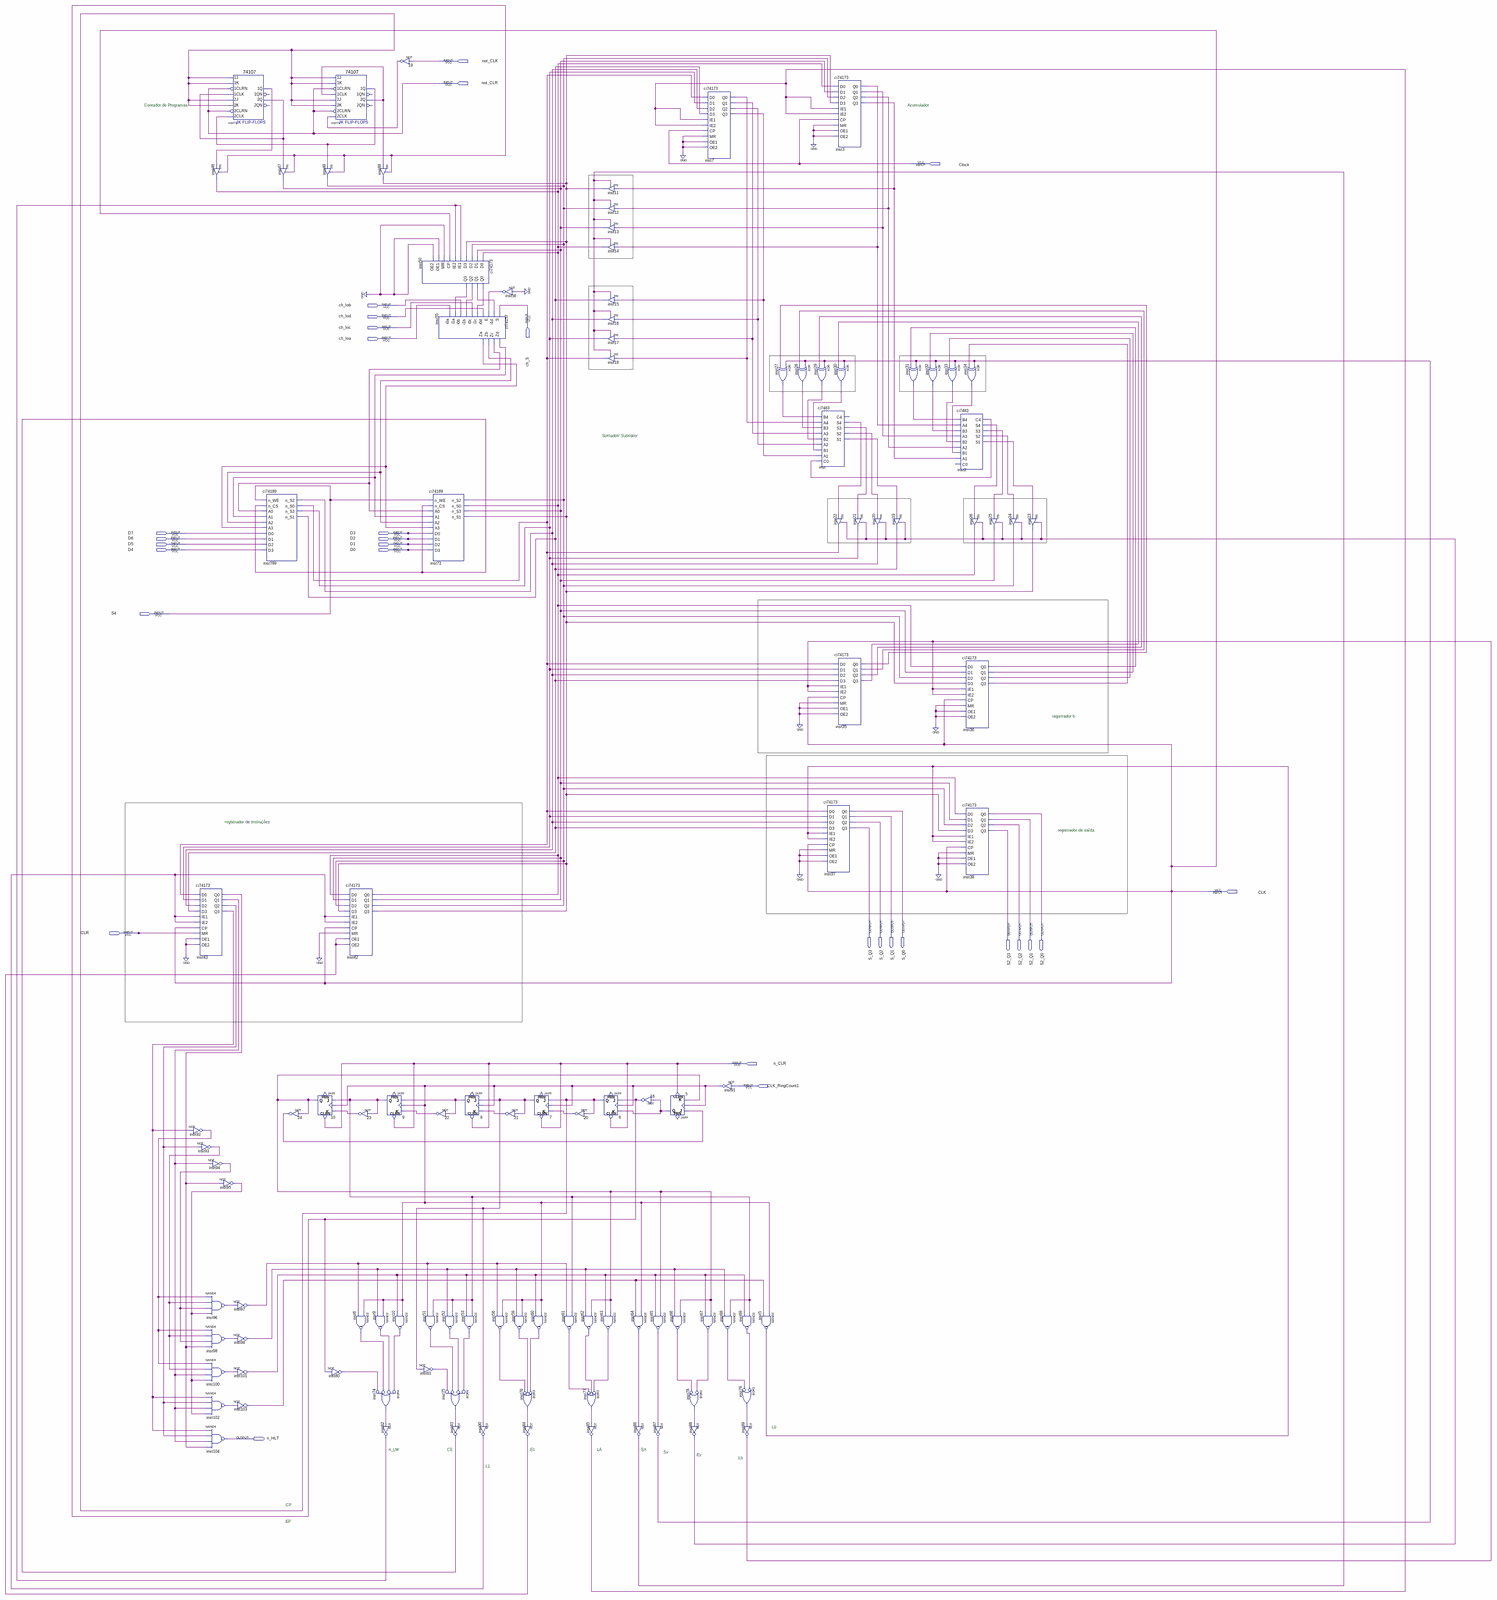
[diagram p0: schematic sheet, whole]
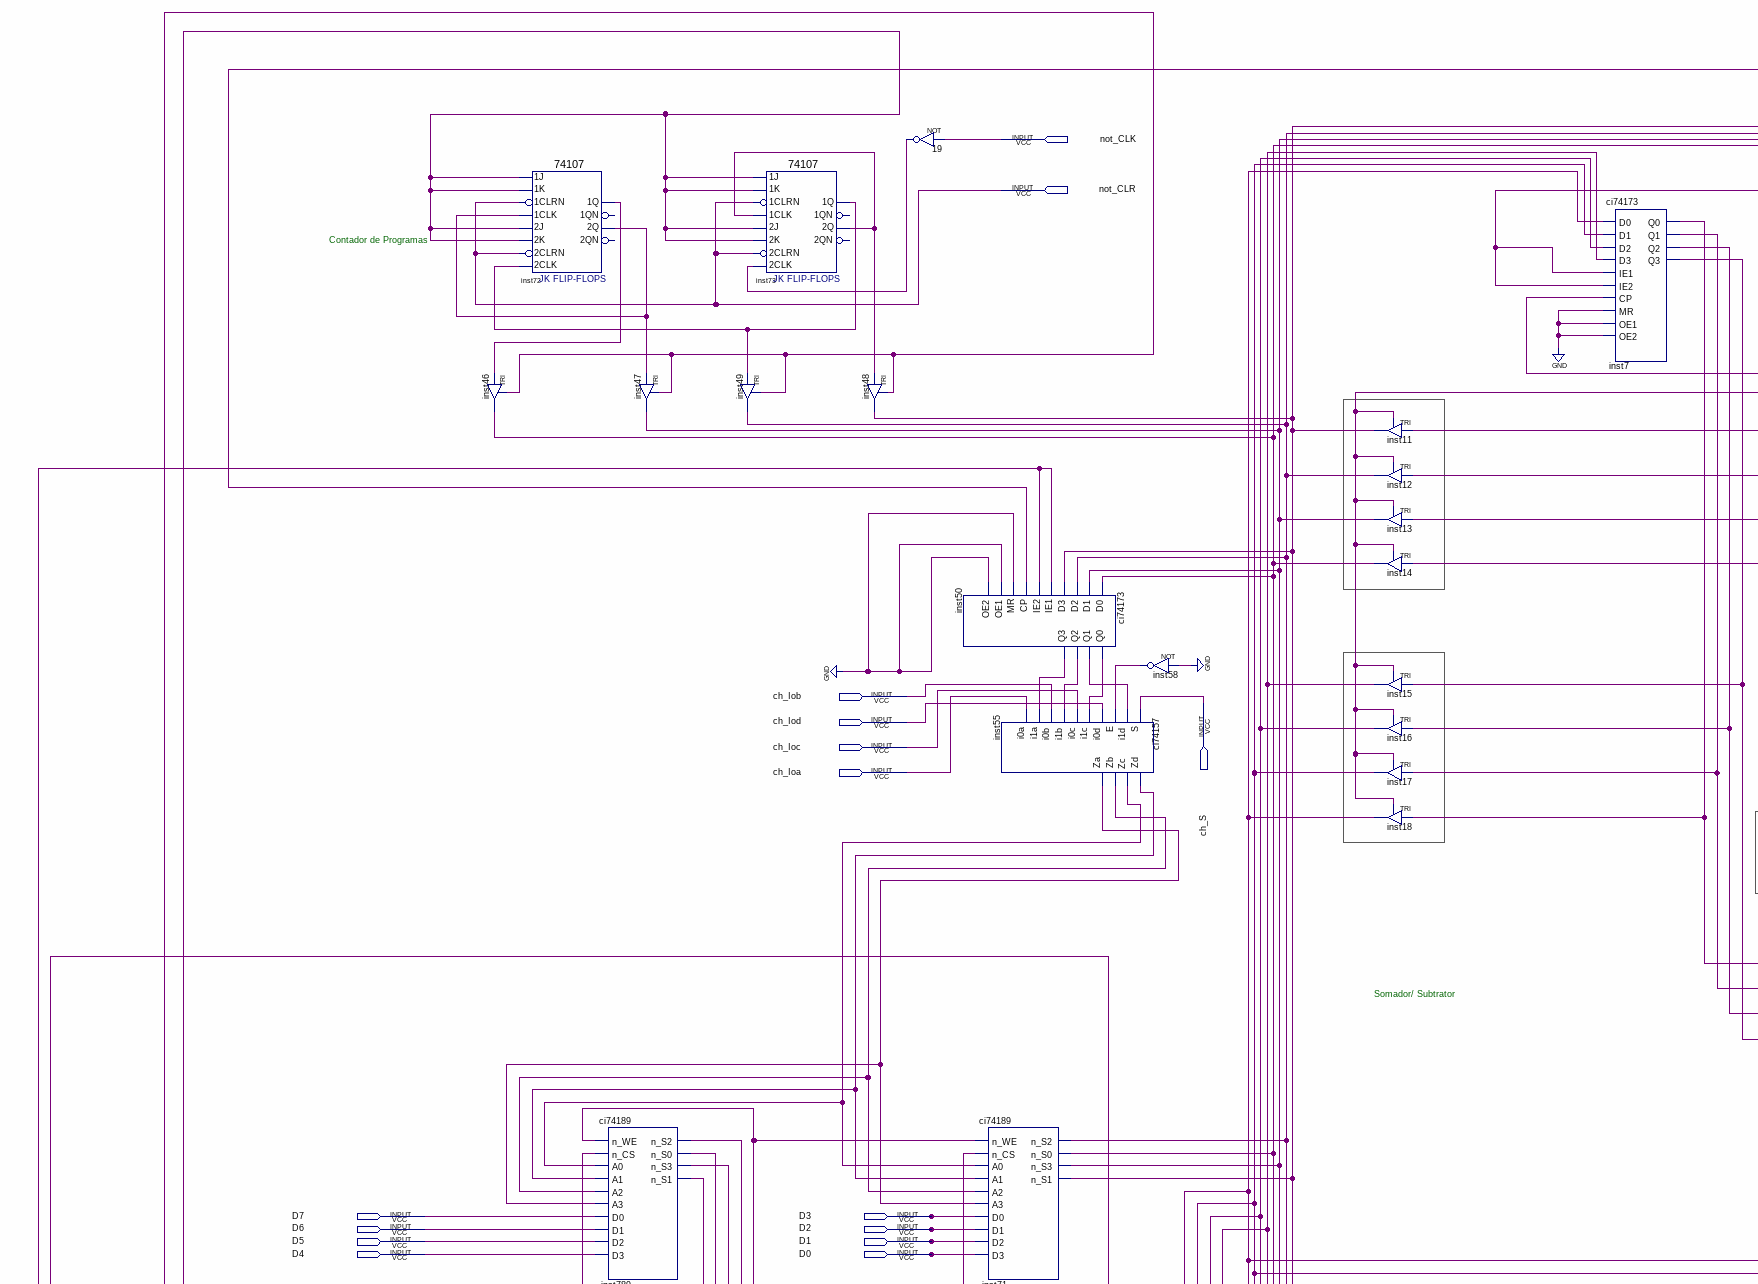
[diagram p1: schematic sheet, upper left part]
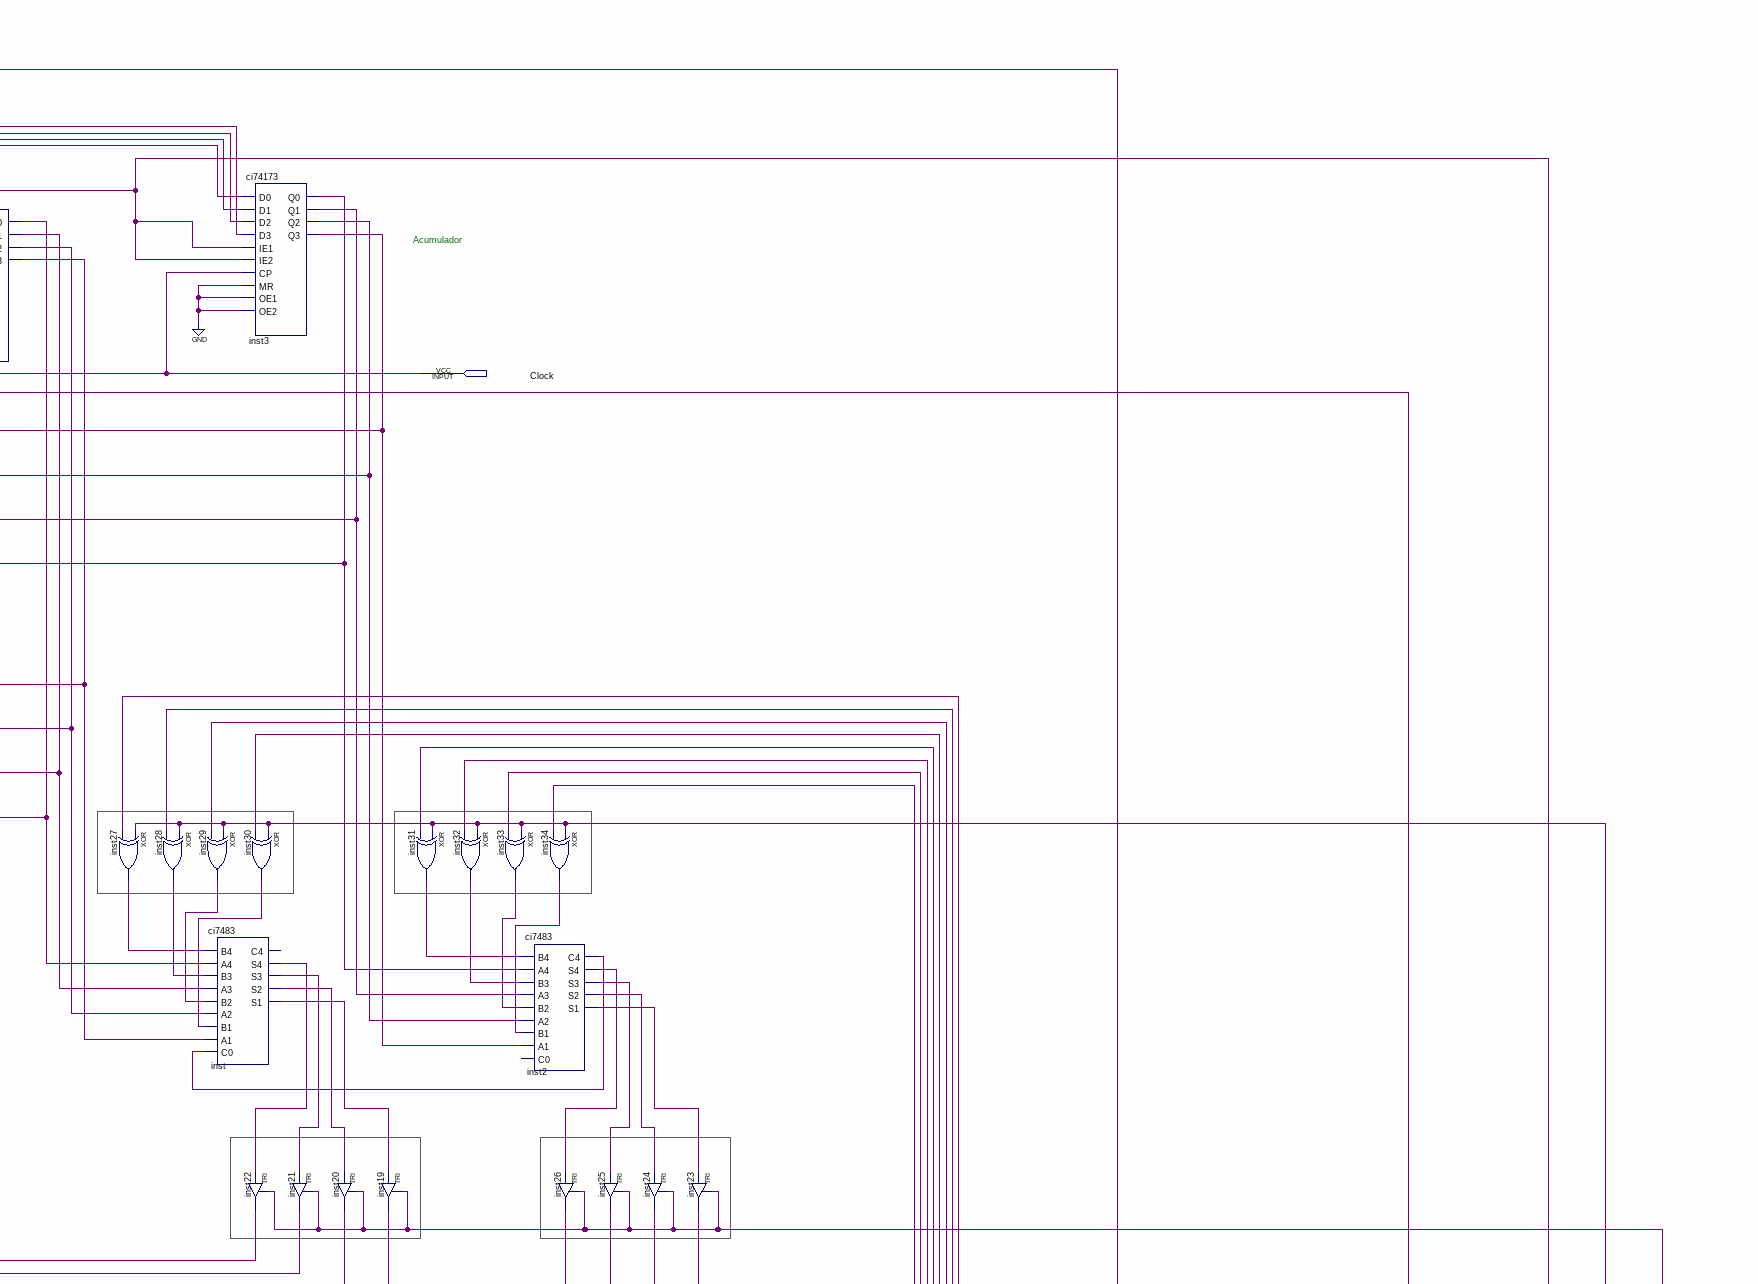
[diagram p2: schematic sheet, upper right part]
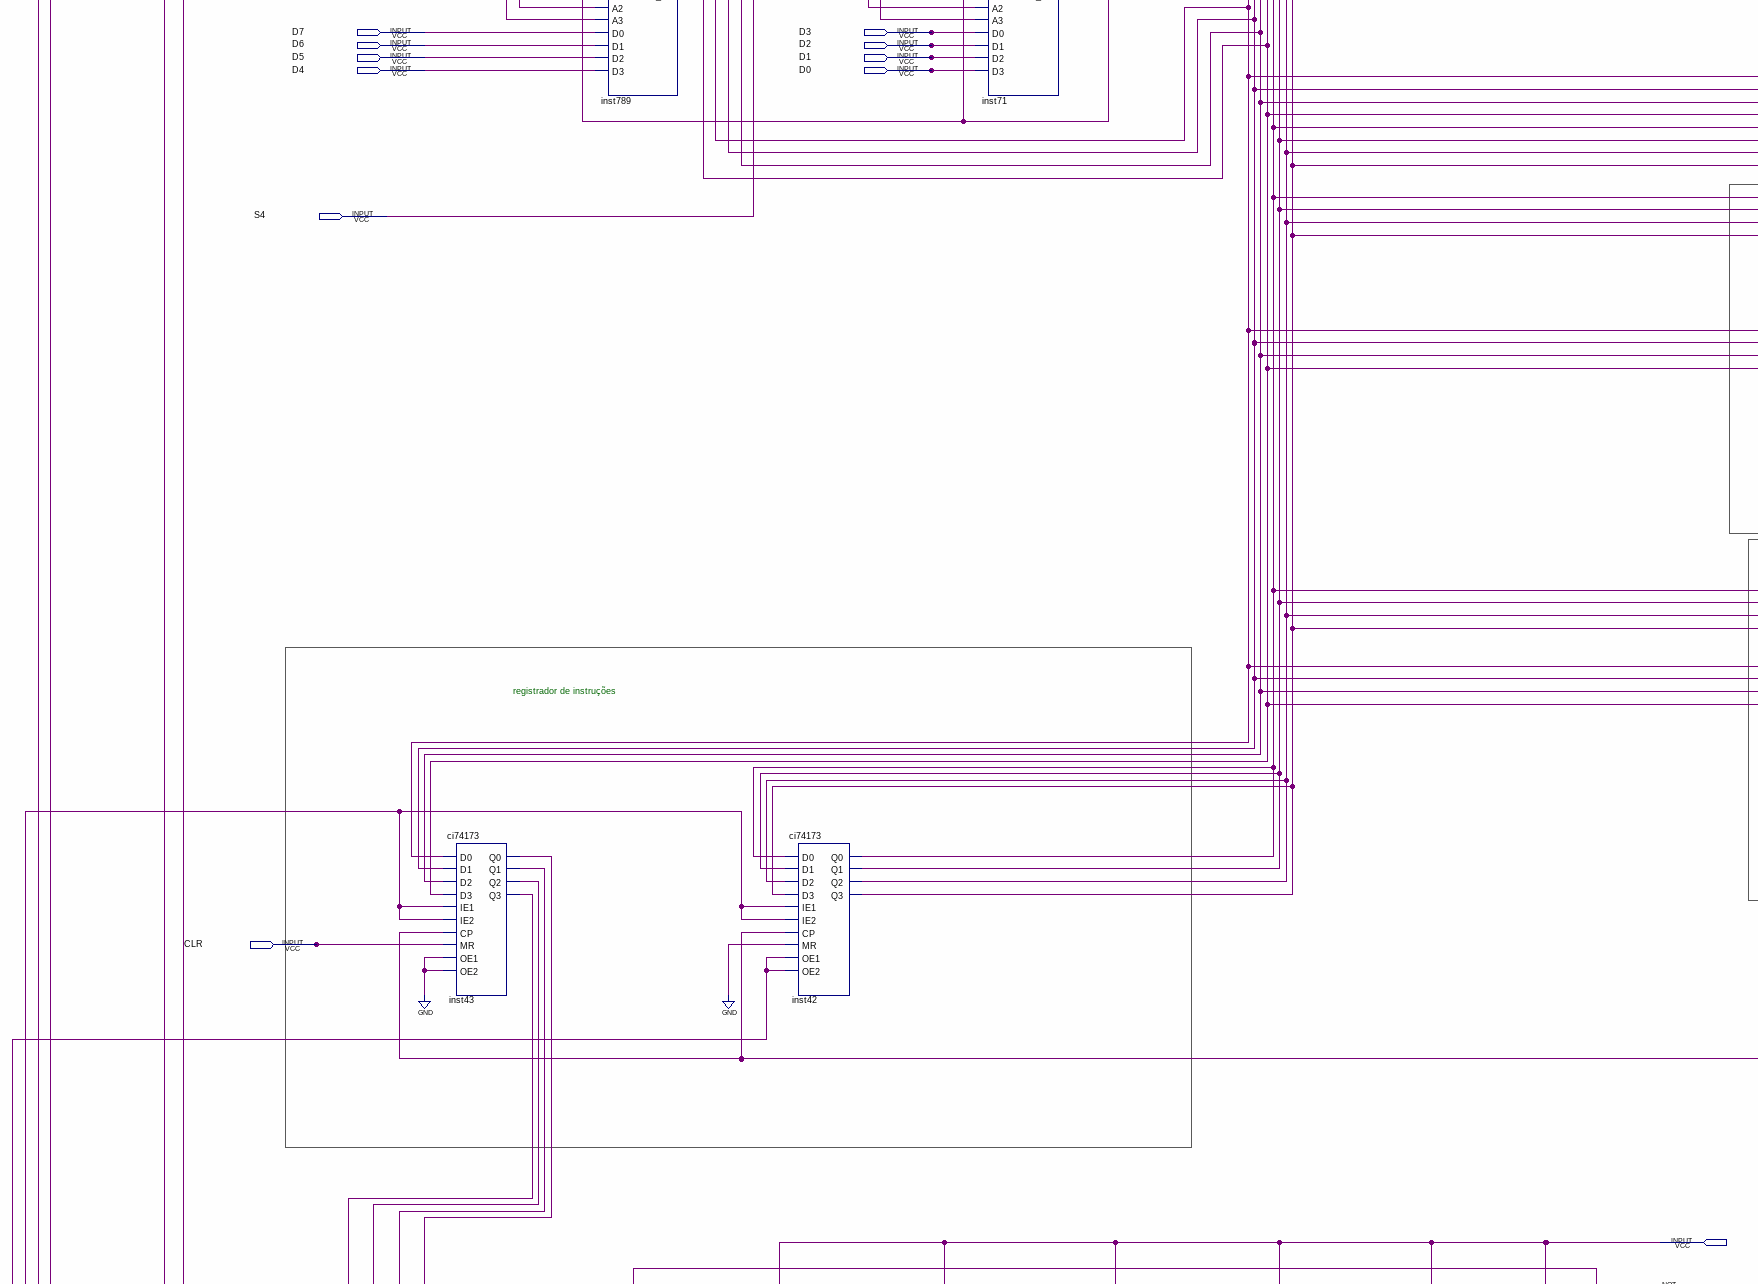
[diagram p3: schematic sheet, middle left part]
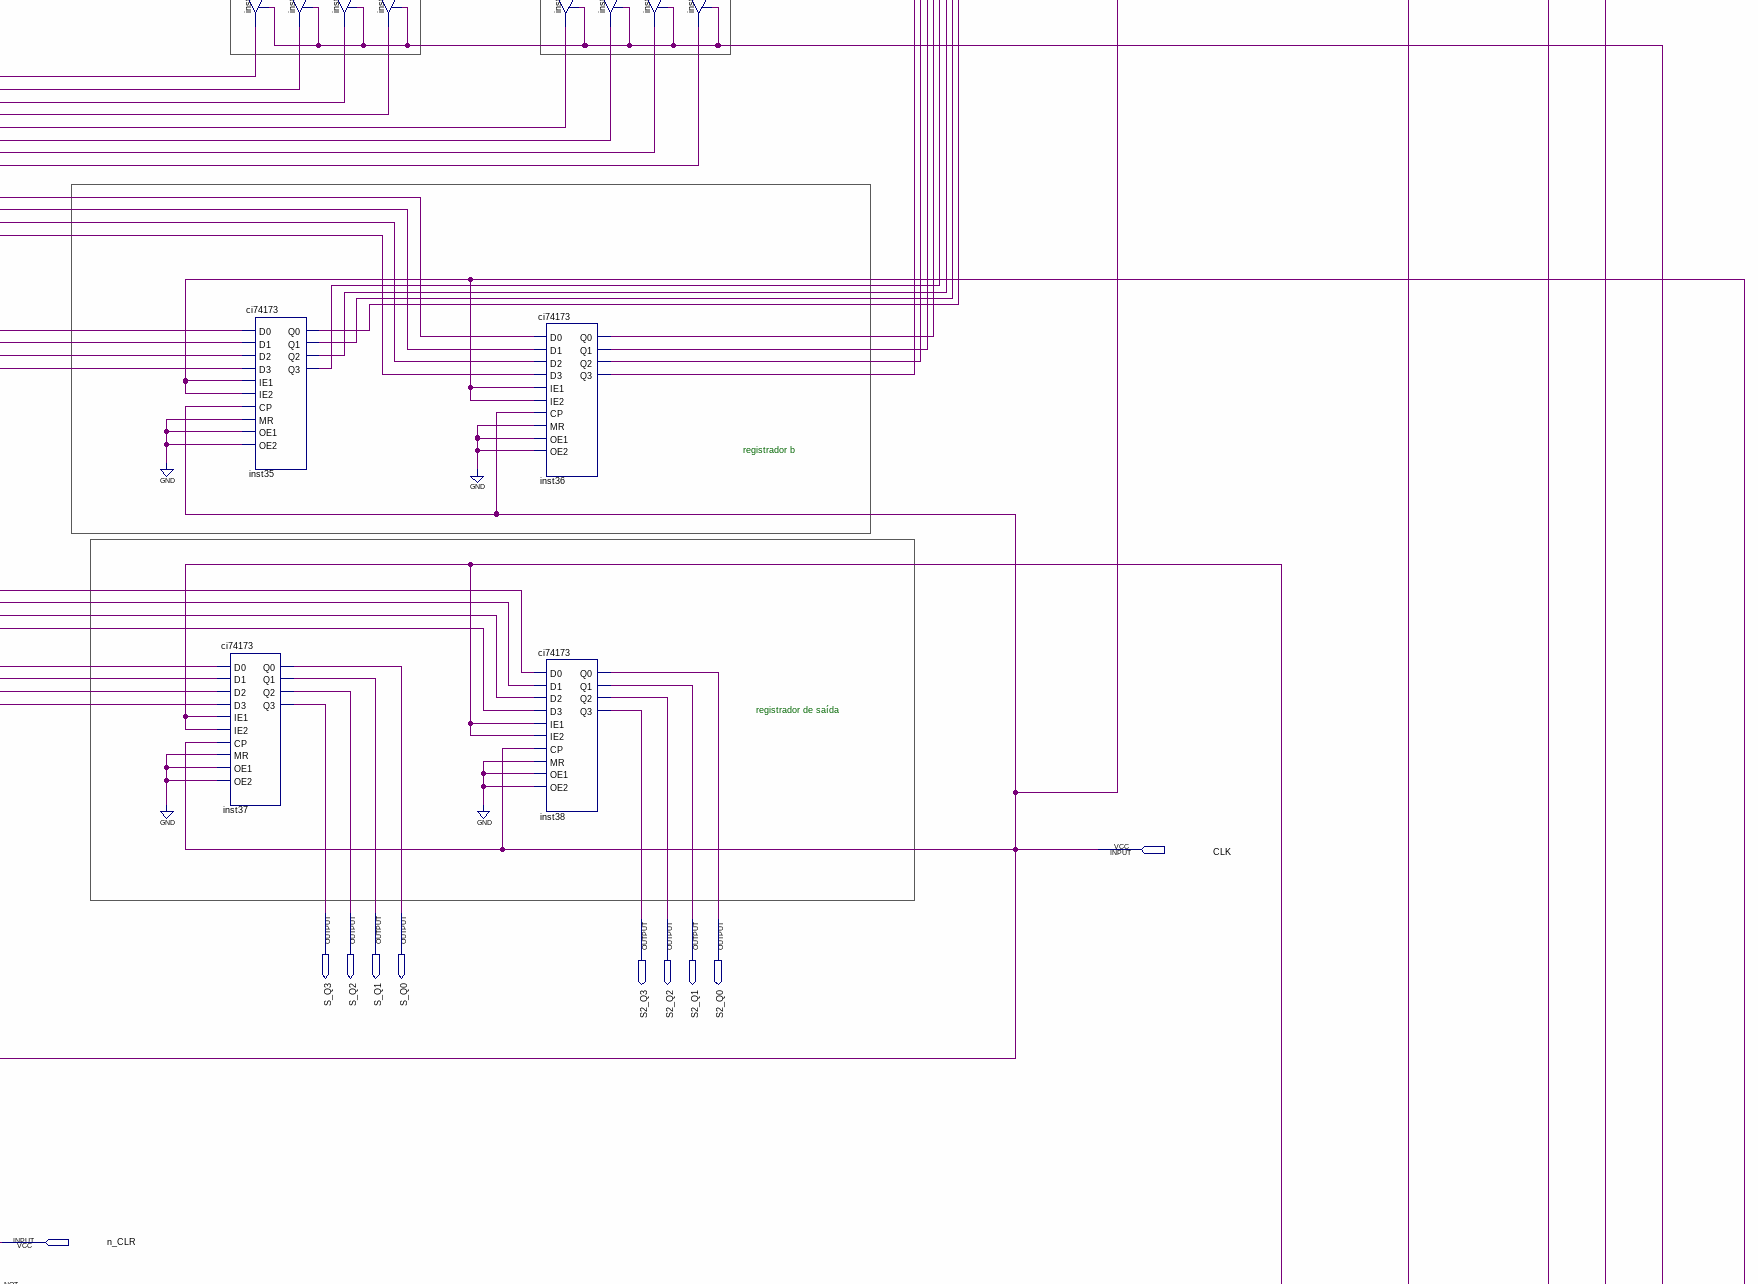
[diagram p4: schematic sheet, middle right part]
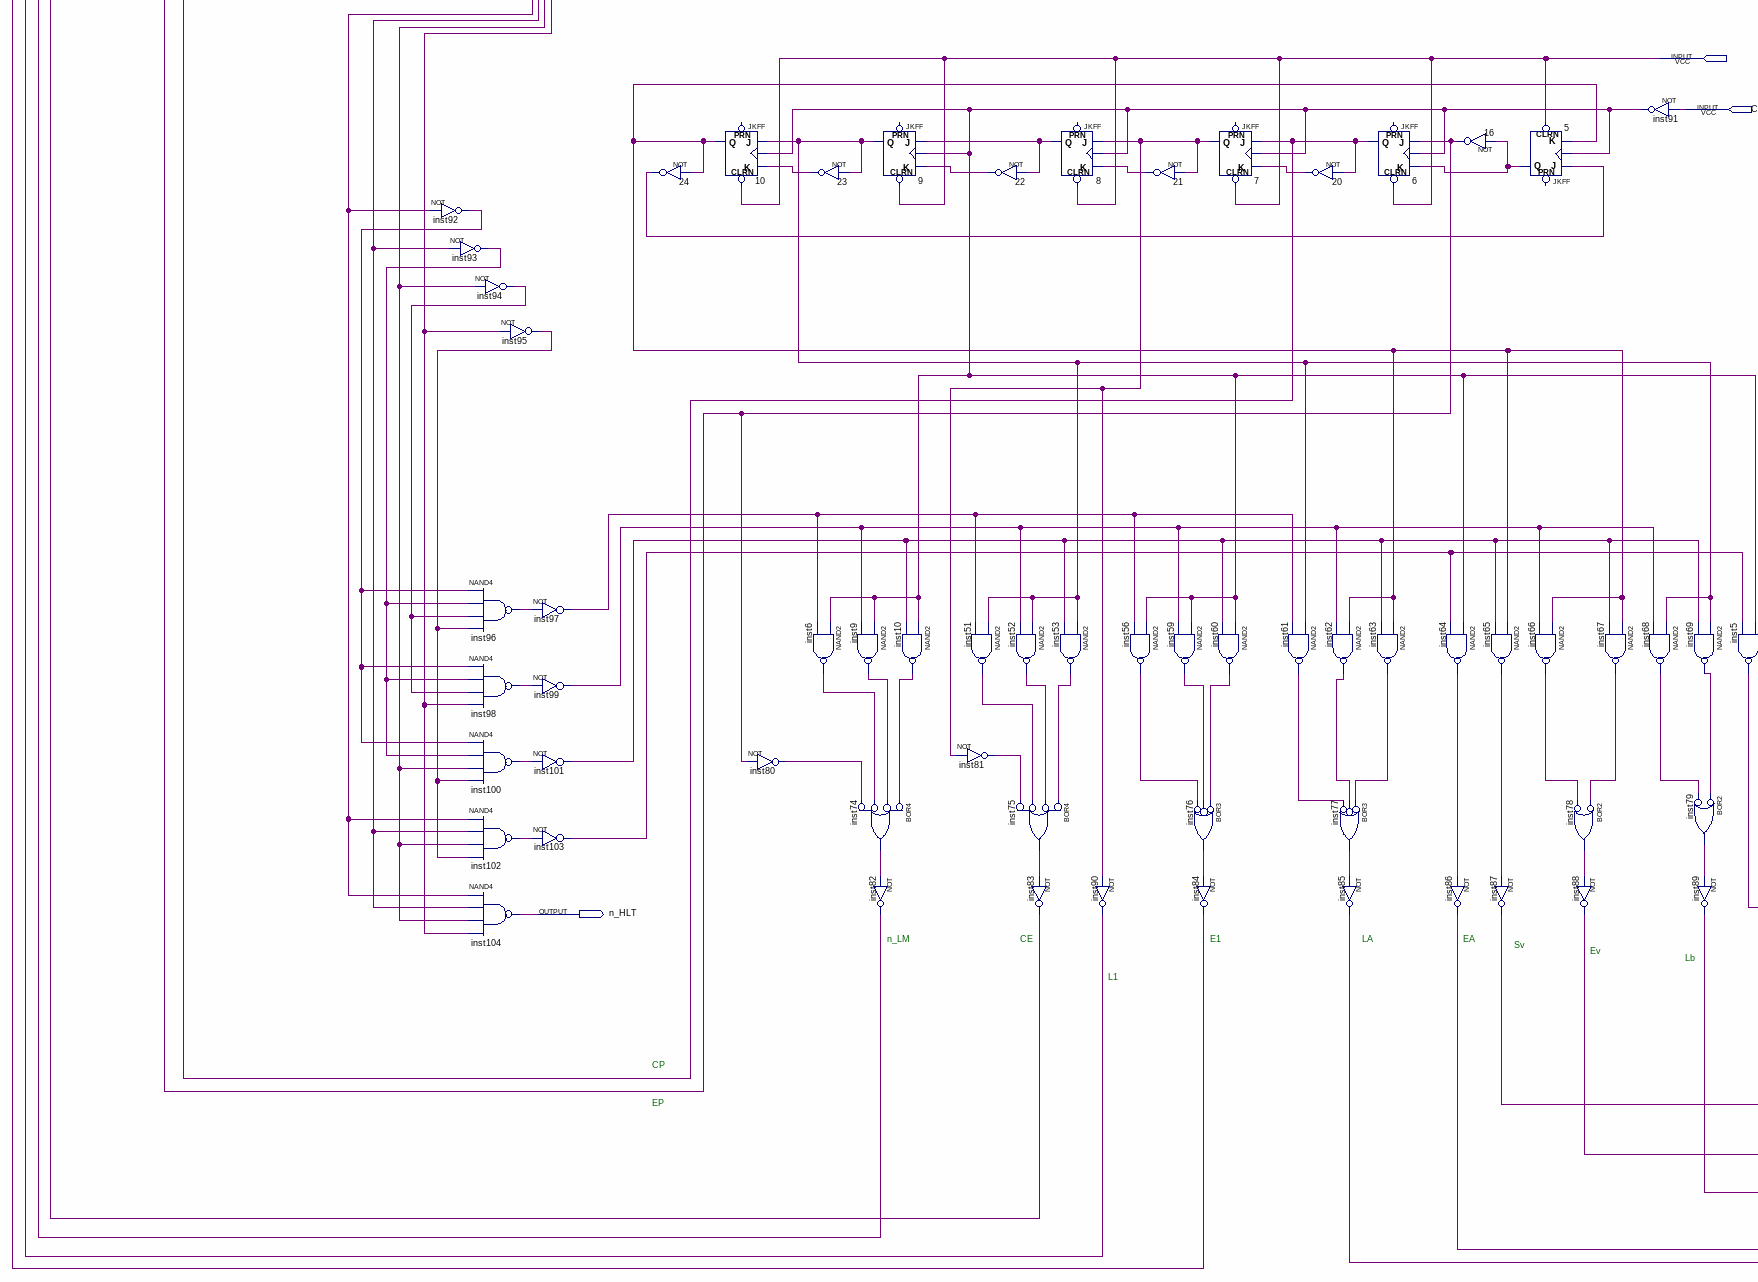
[diagram p5: schematic sheet, lower left part]
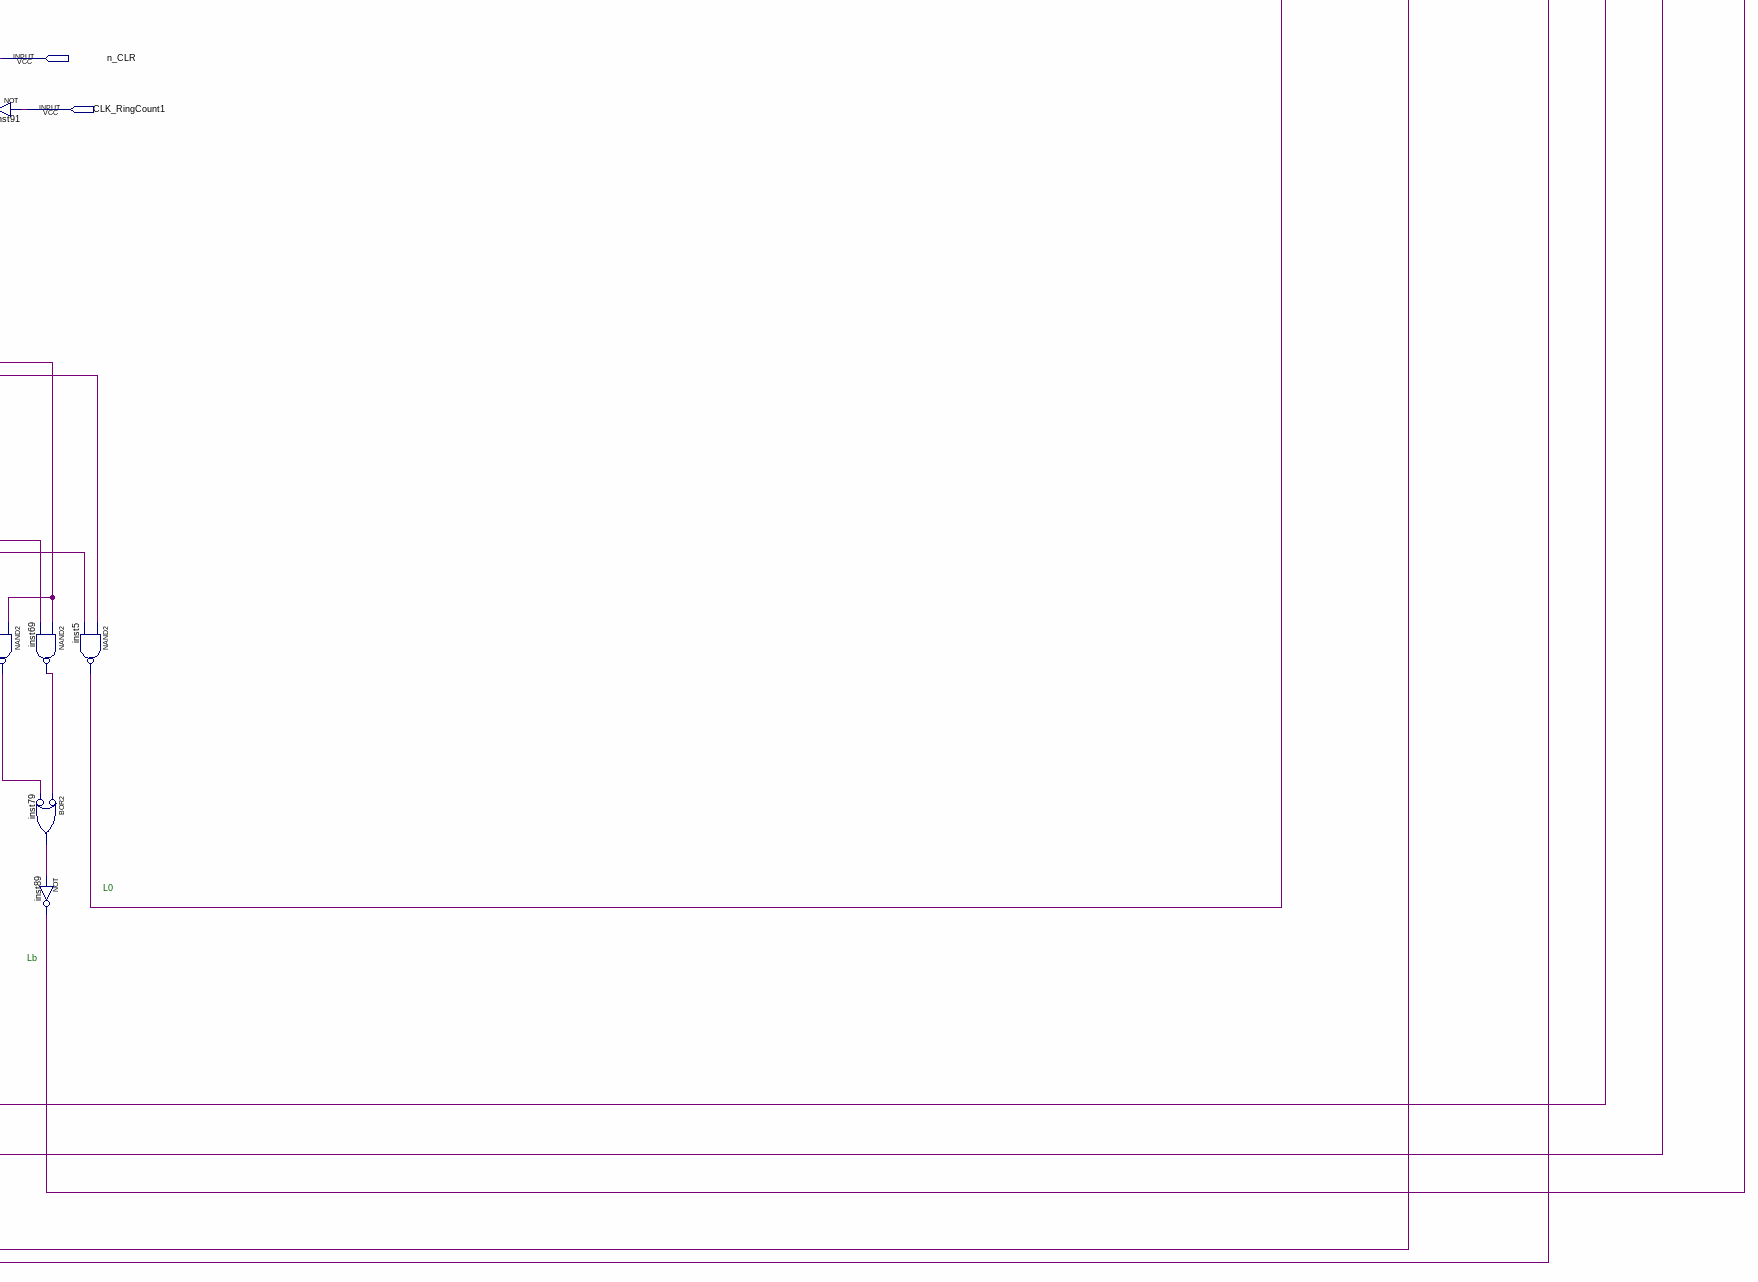
[diagram p6: schematic sheet, lower right part]
// Quartus schematic sap1.bdf as structural Verilog: 108 symbols, 30 pins
module sap1 (
  input  not_CLK,
  input  not_CLR,
  input  Clock,
  input  ch_Iob,
  input  ch_S,
  input  ch_Iod,
  input  ch_Ioc,
  input  ch_Ioa,
  input  D7,
  input  D3,
  input  D6,
  input  D2,
  input  D5,
  input  D1,
  input  D4,
  input  D0,
  input  S4,
  input  CLK,
  input  CLR,
  input  n_CLR,
  input  CLK_RingCount1,
  output S_Q3,
  output S_Q2,
  output S_Q1,
  output S_Q0,
  output S2_Q3,
  output S2_Q2,
  output S2_Q1,
  output S2_Q0,
  output n_HLT
);

  wire inst2_c4, inst2_s1, inst2_s2, inst2_s3, inst2_s4, inst3_q0, inst3_q1, inst3_q2, inst3_q3, inst5_out,
       inst6_out, inst7_q0, inst7_q1, inst7_q2, inst7_q3, inst9_out, inst10_out, inst27_out, inst28_out,
       inst29_out, inst30_out, inst31_out, inst32_out, inst33_out, inst34_out, inst35_q0, inst35_q1,
       inst35_q2, inst35_q3, inst36_q0, inst36_q1, inst36_q2, inst36_q3, inst42_q3, inst43_q0, inst43_q1,
       inst43_q2, inst43_q3, inst46_out, inst47_out, inst49_out, inst50_q0, inst50_q1, inst50_q2, inst50_q3,
       inst51_out, inst52_out, inst53_out, inst55_za, inst55_zb, inst55_zc, inst55_zd, inst56_out,
       inst58_out, inst59_out, inst60_out, inst61_out, inst62_out, inst63_out, inst64_out, inst65_out,
       inst66_out, inst67_out, inst68_out, inst69_out, inst72_1q, inst72_2q, inst73_1q, inst73_2q,
       inst74_out, inst75_out, inst76_out, inst77_out, inst78_out, inst79_out, inst80_out, inst81_out,
       inst82_out, inst83_out, inst84_out, inst85_out, inst86_out, inst87_out, inst88_out, inst89_out,
       inst90_out, inst91_out, inst92_out, inst93_out, inst94_out, inst95_out, inst96_out, inst97_out,
       inst98_out, inst99_out, inst100_out, inst101_out, inst102_out, inst103_out, inst789_n_s0,
       inst789_n_s1, inst789_n_s2, inst789_n_s3, inst_s1, inst_s2, inst_s3, inst_s4, n5_q, n6_q, n7_q, n8_q,
       n9_q, n10_q, n16_out, n19_out, n20_out, n21_out, n22_out, n23_out, n24_out;

  not inst92 (inst92_out, inst43_q3);
  TRI inst46 (.IN(inst72_1q), .OE(n16_out), .OUT(inst46_out));
  ci74173 inst43 (
    .D0(inst789_n_s0), .D1(inst789_n_s3), .D2(inst789_n_s2), .D3(inst789_n_s1), .IE1(inst90_out),
    .IE2(inst90_out), .CP(CLK), .MR(CLR), .OE1(1'b0), .OE2(1'b0), .Q0(inst43_q0), .Q1(inst43_q1),
    .Q2(inst43_q2), .Q3(inst43_q3));
  not inst93 (inst93_out, inst43_q2);
  not inst94 (inst94_out, inst43_q1);
  nand inst96 (inst96_out, inst92_out, inst93_out, inst94_out, inst95_out);
  nand inst98 (inst98_out, inst92_out, inst93_out, inst94_out, inst43_q0);
  nand inst100 (inst100_out, inst92_out, inst93_out, inst43_q1, inst95_out);
  nand inst102 (inst102_out, inst43_q3, inst43_q2, inst43_q1, inst95_out);
  nand inst104 (n_HLT, inst43_q3, inst43_q2, inst43_q1, inst43_q0);
  \74107  inst72 (
    .\1CLRN (not_CLR), .\1K (n6_q), .\1J (n6_q), .\2K (n6_q), .\2J (n6_q), .\1CLK (inst72_2q),
    .\2CLK (inst73_1q), .\2CLRN (not_CLR), .\1Q (inst72_1q), .\2Q (inst72_2q));  // open: 1QN, 2QN
  not inst95 (inst95_out, inst43_q0);
  not inst97 (inst97_out, inst96_out);
  not inst99 (inst99_out, inst98_out);
  not inst101 (inst101_out, inst100_out);
  not inst103 (inst103_out, inst102_out);
  TRI inst47 (.IN(inst72_2q), .OE(n16_out), .OUT(inst47_out));
  ci74189 inst789 (
    .n_WE(S4), .n_CS(inst83_out), .A0(inst55_zc), .A1(inst55_zd), .A2(inst55_zb), .A3(inst55_za), .D0(D7),
    .D1(D6), .D2(D5), .D3(D4), .n_S2(inst789_n_s2), .n_S0(inst789_n_s0), .n_S3(inst789_n_s3),
    .n_S1(inst789_n_s1));
  not u_24 (n24_out, n10_q);
  TRI inst49 (.IN(inst73_1q), .OE(n16_out), .OUT(inst49_out));
  JKFF u_10 (.CLRN(n_CLR), .K(n23_out), .J(n9_q), .CLK(inst91_out), .Q(n10_q));  // open: PRN
  \74107  inst73 (
    .\1CLRN (not_CLR), .\1K (n6_q), .\1J (n6_q), .\2K (n6_q), .\2J (n6_q), .\1CLK (inst73_2q),
    .\2CLK (n19_out), .\2CLRN (not_CLR), .\1Q (inst73_1q), .\2Q (inst73_2q));  // open: 1QN, 2QN
  ci74173 inst42 (
    .D0(inst46_out), .D1(inst47_out), .D2(inst49_out), .D3(inst42_q3), .IE1(inst90_out), .IE2(inst90_out),
    .CP(CLK), .MR(1'b0), .OE1(inst84_out), .OE2(inst84_out), .Q0(inst46_out), .Q1(inst47_out),
    .Q2(inst49_out), .Q3(inst42_q3));
  not inst80 (inst80_out, n16_out);
  not u_23 (n23_out, n9_q);
  nand inst6 (inst6_out, inst91_out, inst97_out);
  TRI inst48 (.IN(inst73_2q), .OE(n16_out), .OUT(inst42_q3));
  JKFF u_9 (.CLRN(n_CLR), .K(n22_out), .J(n8_q), .CLK(inst91_out), .Q(n9_q));  // open: PRN
  nand inst9 (inst9_out, inst91_out, inst99_out);
  or inst74 (inst74_out, ~inst10_out, ~inst9_out, ~inst6_out, ~inst80_out);  // BOR4
  not inst82 (inst82_out, inst74_out);
  not u_19 (n19_out, not_CLK);
  nand inst10 (inst10_out, inst91_out, inst101_out);
  ci74173 inst50 (
    .D0(inst46_out), .D1(inst47_out), .D2(inst49_out), .D3(inst42_q3), .IE1(inst82_out), .IE2(inst82_out),
    .CP(CLK), .MR(1'b0), .OE1(1'b0), .OE2(1'b0), .Q0(inst50_q0), .Q1(inst50_q1), .Q2(inst50_q2),
    .Q3(inst50_q3));
  ci74157 inst55 (
    .S(ch_S), .i1d(inst50_q1), .E(inst58_out), .i0d(ch_Iod), .i1c(inst50_q0), .i0c(ch_Ioc), .i1b(inst50_q2),
    .i0b(ch_Iob), .i1a(inst50_q3), .i0a(ch_Ioa), .Zd(inst55_zd), .Zc(inst55_zc), .Zb(inst55_zb),
    .Za(inst55_za));
  ci74189 inst71 (
    .n_WE(S4), .n_CS(inst83_out), .A0(inst55_zc), .A1(inst55_zd), .A2(inst55_zb), .A3(inst55_za), .D0(D3),
    .D1(D2), .D2(D1), .D3(D0), .n_S2(inst49_out), .n_S0(inst46_out), .n_S3(inst47_out), .n_S1(inst42_q3));
  not u_22 (n22_out, n8_q);
  nand inst51 (inst51_out, n9_q, inst97_out);
  not inst81 (inst81_out, n7_q);
  nand inst52 (inst52_out, n9_q, inst99_out);
  or inst75 (inst75_out, ~inst53_out, ~inst52_out, ~inst51_out, ~inst81_out);  // BOR4
  not inst83 (inst83_out, inst75_out);
  JKFF u_8 (.CLRN(n_CLR), .K(n21_out), .J(n7_q), .CLK(inst91_out), .Q(n8_q));  // open: PRN
  nand inst53 (inst53_out, n9_q, inst101_out);
  not inst90 (inst90_out, n7_q);
  not inst58 (inst58_out, 1'b0);
  nand inst56 (inst56_out, inst91_out, inst97_out);
  not u_21 (n21_out, n7_q);
  nand inst59 (inst59_out, inst91_out, inst99_out);
  or inst76 (inst76_out, ~inst60_out, ~inst59_out, ~inst56_out);  // BOR3
  not inst84 (inst84_out, inst76_out);
  JKFF u_7 (.CLRN(n_CLR), .K(n20_out), .J(n6_q), .CLK(inst91_out), .Q(n7_q));  // open: PRN
  nand inst60 (inst60_out, inst91_out, inst101_out);
  nand inst61 (inst61_out, n9_q, inst97_out);
  not u_20 (n20_out, n6_q);
  nand inst62 (inst62_out, n10_q, inst99_out);
  or inst77 (inst77_out, ~inst63_out, ~inst62_out, ~inst61_out);  // BOR3
  not inst85 (inst85_out, inst77_out);
  TRI inst11 (.IN(inst3_q3), .OE(inst86_out), .OUT(inst42_q3));
  TRI inst12 (.IN(inst3_q2), .OE(inst86_out), .OUT(inst49_out));
  TRI inst13 (.IN(inst3_q1), .OE(inst86_out), .OUT(inst47_out));
  TRI inst14 (.IN(inst3_q0), .OE(inst86_out), .OUT(inst46_out));
  TRI inst15 (.IN(inst7_q3), .OE(inst86_out), .OUT(inst789_n_s1));
  TRI inst16 (.IN(inst7_q2), .OE(inst86_out), .OUT(inst789_n_s2));
  TRI inst17 (.IN(inst7_q1), .OE(inst86_out), .OUT(inst789_n_s3));
  TRI inst18 (.IN(inst7_q0), .OE(inst86_out), .OUT(inst789_n_s0));
  JKFF u_6 (.CLRN(n_CLR), .K(n5_q), .J(n16_out), .CLK(inst91_out), .Q(n6_q));  // open: PRN
  nand inst63 (inst63_out, n10_q, inst101_out);
  nand inst64 (inst64_out, inst91_out, inst103_out);
  not inst86 (inst86_out, inst64_out);
  not u_16 (n16_out, n5_q);
  nand inst65 (inst65_out, n10_q, inst101_out);
  not inst87 (inst87_out, inst65_out);
  JKFF u_5 (.CLRN(n_CLR), .K(n10_q), .J(n24_out), .CLK(inst91_out), .Q(n5_q));  // open: PRN
  nand inst66 (inst66_out, n10_q, inst99_out);
  nand inst67 (inst67_out, n10_q, inst101_out);
  or inst78 (inst78_out, ~inst67_out, ~inst66_out);  // BOR2
  not inst88 (inst88_out, inst78_out);
  ci74173 inst7 (
    .D0(inst789_n_s0), .D1(inst789_n_s3), .D2(inst789_n_s2), .D3(inst789_n_s1), .IE1(inst85_out),
    .IE2(inst85_out), .CP(Clock), .MR(1'b0), .OE1(1'b0), .OE2(1'b0), .Q0(inst7_q0), .Q1(inst7_q1),
    .Q2(inst7_q2), .Q3(inst7_q3));
  not inst91 (inst91_out, CLK_RingCount1);
  nand inst68 (inst68_out, n9_q, inst99_out);
  nand inst69 (inst69_out, n9_q, inst101_out);
  or inst79 (inst79_out, ~inst69_out, ~inst68_out);  // BOR2
  not inst89 (inst89_out, inst79_out);
  nand inst5 (inst5_out, inst91_out, inst103_out);
  xor inst27 (inst27_out, inst87_out, inst35_q0);
  xor inst28 (inst28_out, inst87_out, inst35_q1);
  ci74173 inst3 (
    .D0(inst46_out), .D1(inst47_out), .D2(inst49_out), .D3(inst42_q3), .IE1(inst85_out), .IE2(inst85_out),
    .CP(Clock), .MR(1'b0), .OE1(1'b0), .OE2(1'b0), .Q0(inst3_q0), .Q1(inst3_q1), .Q2(inst3_q2), .Q3(inst3_q3));
  xor inst29 (inst29_out, inst87_out, inst35_q2);
  xor inst30 (inst30_out, inst87_out, inst35_q3);
  ci7483 inst (
    .B4(inst27_out), .A4(inst7_q0), .B3(inst28_out), .A3(inst7_q1), .B2(inst29_out), .A2(inst7_q2),
    .B1(inst30_out), .A1(inst7_q3), .C0(inst2_c4), .S4(inst_s4), .S3(inst_s3), .S2(inst_s2), .S1(inst_s1));  // open: C4
  TRI inst22 (.IN(inst_s4), .OE(inst88_out), .OUT(inst789_n_s0));
  ci74173 inst35 (
    .D0(inst789_n_s0), .D1(inst789_n_s3), .D2(inst789_n_s2), .D3(inst789_n_s1), .IE1(inst89_out),
    .IE2(inst89_out), .CP(CLK), .MR(1'b0), .OE1(1'b0), .OE2(1'b0), .Q0(inst35_q0), .Q1(inst35_q1),
    .Q2(inst35_q2), .Q3(inst35_q3));
  ci74173 inst37 (
    .D0(inst789_n_s0), .D1(inst789_n_s3), .D2(inst789_n_s2), .D3(inst789_n_s1), .IE1(inst5_out),
    .IE2(inst5_out), .CP(CLK), .MR(1'b0), .OE1(1'b0), .OE2(1'b0), .Q0(S_Q0), .Q1(S_Q1), .Q2(S_Q2), .Q3(S_Q3));
  TRI inst21 (.IN(inst_s3), .OE(inst88_out), .OUT(inst789_n_s3));
  TRI inst20 (.IN(inst_s2), .OE(inst88_out), .OUT(inst789_n_s2));
  TRI inst19 (.IN(inst_s1), .OE(inst88_out), .OUT(inst789_n_s1));
  xor inst31 (inst31_out, inst87_out, inst36_q0);
  xor inst32 (inst32_out, inst87_out, inst36_q1);
  xor inst33 (inst33_out, inst87_out, inst36_q2);
  xor inst34 (inst34_out, inst87_out, inst36_q3);
  ci7483 inst2 (
    .B4(inst31_out), .A4(inst3_q0), .B3(inst32_out), .A3(inst3_q1), .B2(inst33_out), .A2(inst3_q2),
    .B1(inst34_out), .A1(inst3_q3), .C4(inst2_c4), .S4(inst2_s4), .S3(inst2_s3), .S2(inst2_s2), .S1(inst2_s1));  // open: C0
  ci74173 inst36 (
    .D0(inst46_out), .D1(inst47_out), .D2(inst49_out), .D3(inst42_q3), .IE1(inst89_out), .IE2(inst89_out),
    .CP(CLK), .MR(1'b0), .OE1(1'b0), .OE2(1'b0), .Q0(inst36_q0), .Q1(inst36_q1), .Q2(inst36_q2),
    .Q3(inst36_q3));
  ci74173 inst38 (
    .D0(inst46_out), .D1(inst47_out), .D2(inst49_out), .D3(inst42_q3), .IE1(inst5_out), .IE2(inst5_out),
    .CP(CLK), .MR(1'b0), .OE1(1'b0), .OE2(1'b0), .Q0(S2_Q0), .Q1(S2_Q1), .Q2(S2_Q2), .Q3(S2_Q3));
  TRI inst25 (.IN(inst2_s3), .OE(inst88_out), .OUT(inst47_out));
  TRI inst26 (.IN(inst2_s4), .OE(inst88_out), .OUT(inst46_out));
  TRI inst24 (.IN(inst2_s2), .OE(inst88_out), .OUT(inst49_out));
  TRI inst23 (.IN(inst2_s1), .OE(inst88_out), .OUT(inst42_q3));

  // Notes on the sheet:
  //   Contador de Programas
  //   Acumulador
  //   Somador/ Subtrator
  //   registrador b
  //   registrador de instruções
  //   registrador de saída
  //   L0
  //   n_LM
  //   CE
  //   E1
  //   LA
  //   EA
  //   Sv
  //   Ev
  //   Lb
  //   L1
  //   CP
  //   EP
endmodule
